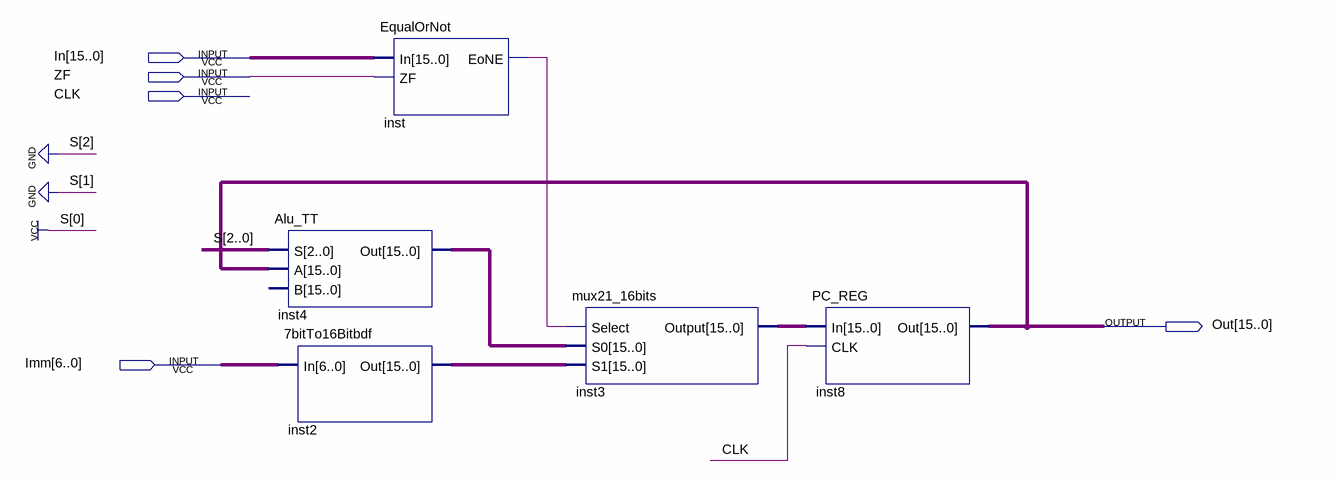
[diagram p0: schematic sheet]
// Quartus schematic PC_Design.bdf as structural Verilog: 5 symbols, 5 pins
module PC_Design (
  input  [15:0] In,
  input  ZF,
  input  CLK,
  input  [6:0] Imm,
  output [15:0] Out
);

  wire inst_eone;
  wire [15:0] inst2_out, inst3_output, inst4_out;

  Alu_TT inst4 (.S(3'b001), .A(Out), .Out(inst4_out));  // open: B
  \7bitTo16Bitbdf  inst2 (.In(Imm), .Out(inst2_out));
  EqualOrNot inst (.In(In), .ZF(ZF), .EoNE(inst_eone));
  mux21_16bits inst3 (.Select(inst_eone), .S0(inst4_out), .S1(inst2_out), .Output(inst3_output));
  PC_REG inst8 (.In(inst3_output), .CLK(CLK), .Out(Out));
endmodule
